# EAGLE board RASPILOT_BETA (EAGLE 7.2.0)
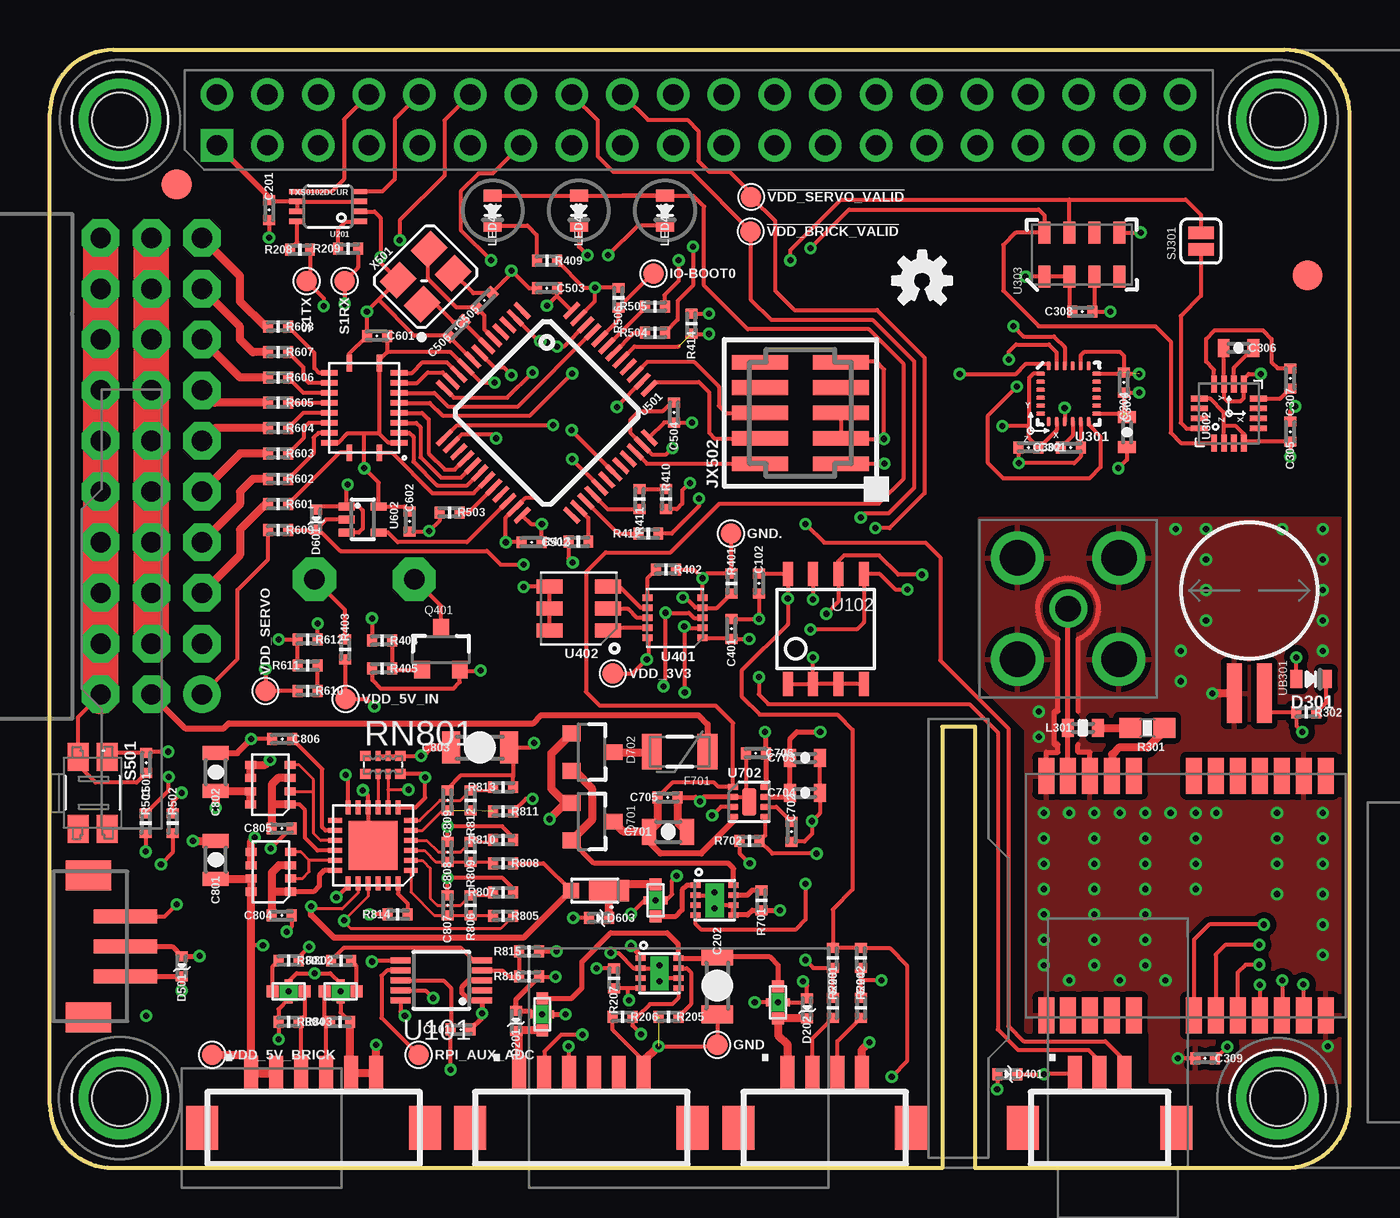
[diagram p9: board, top side]
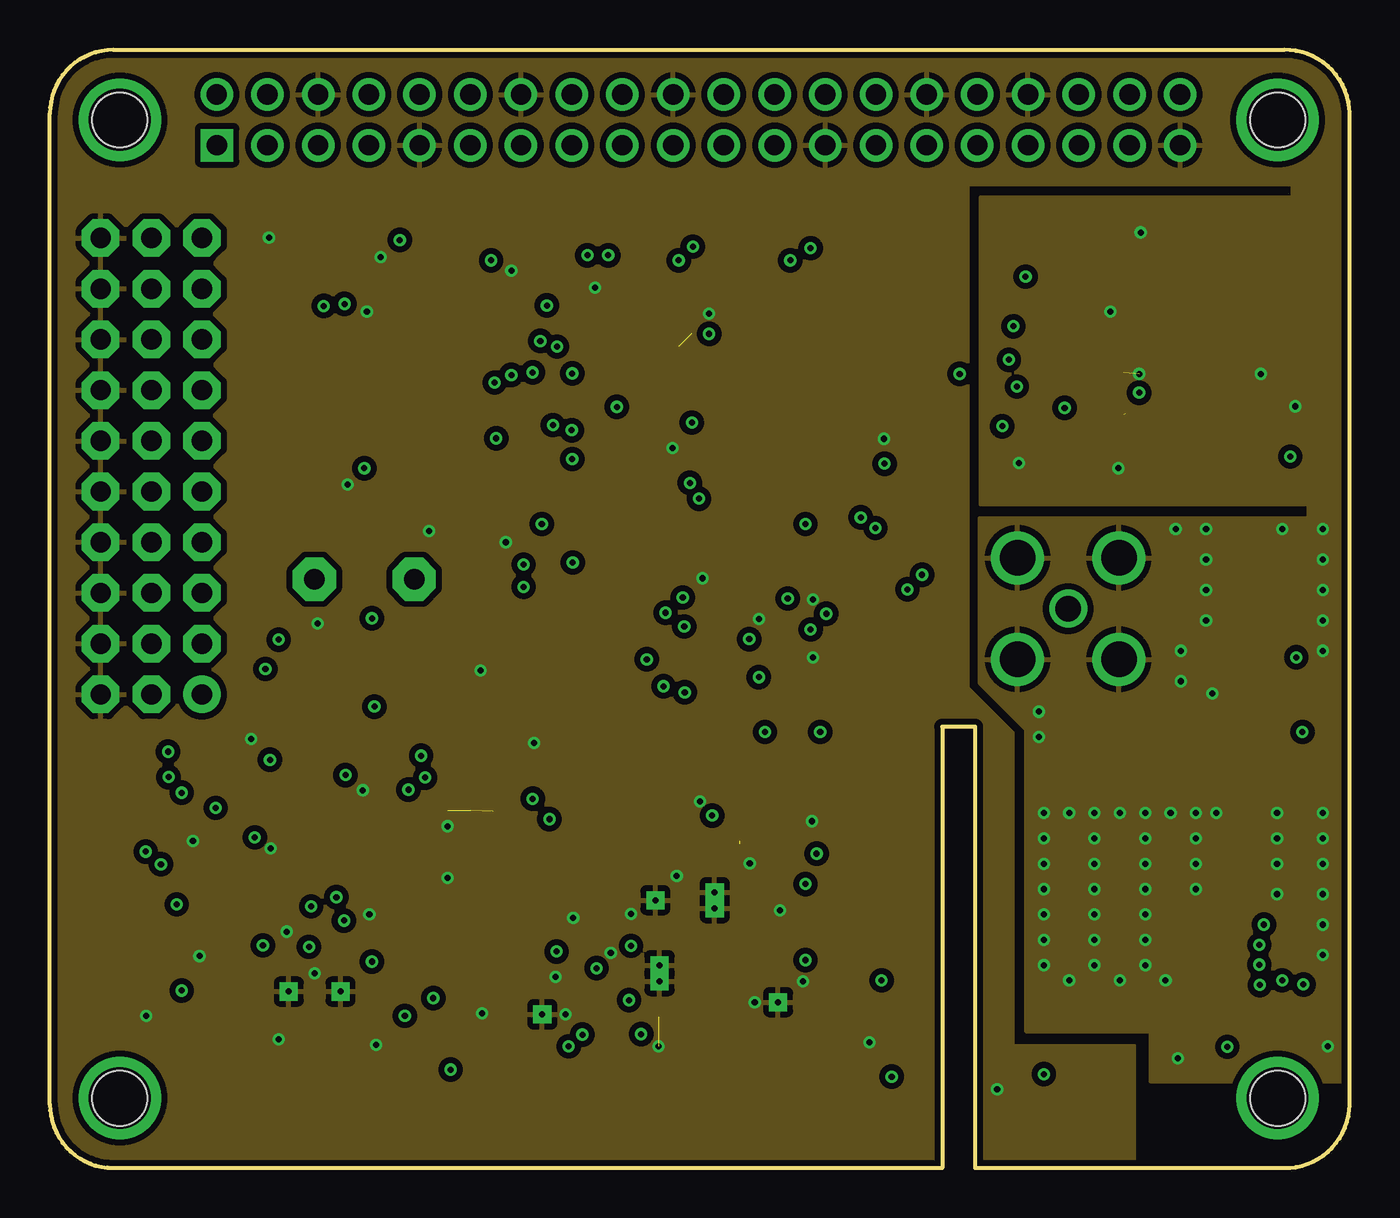
[diagram p10: board, inner layer Ground]
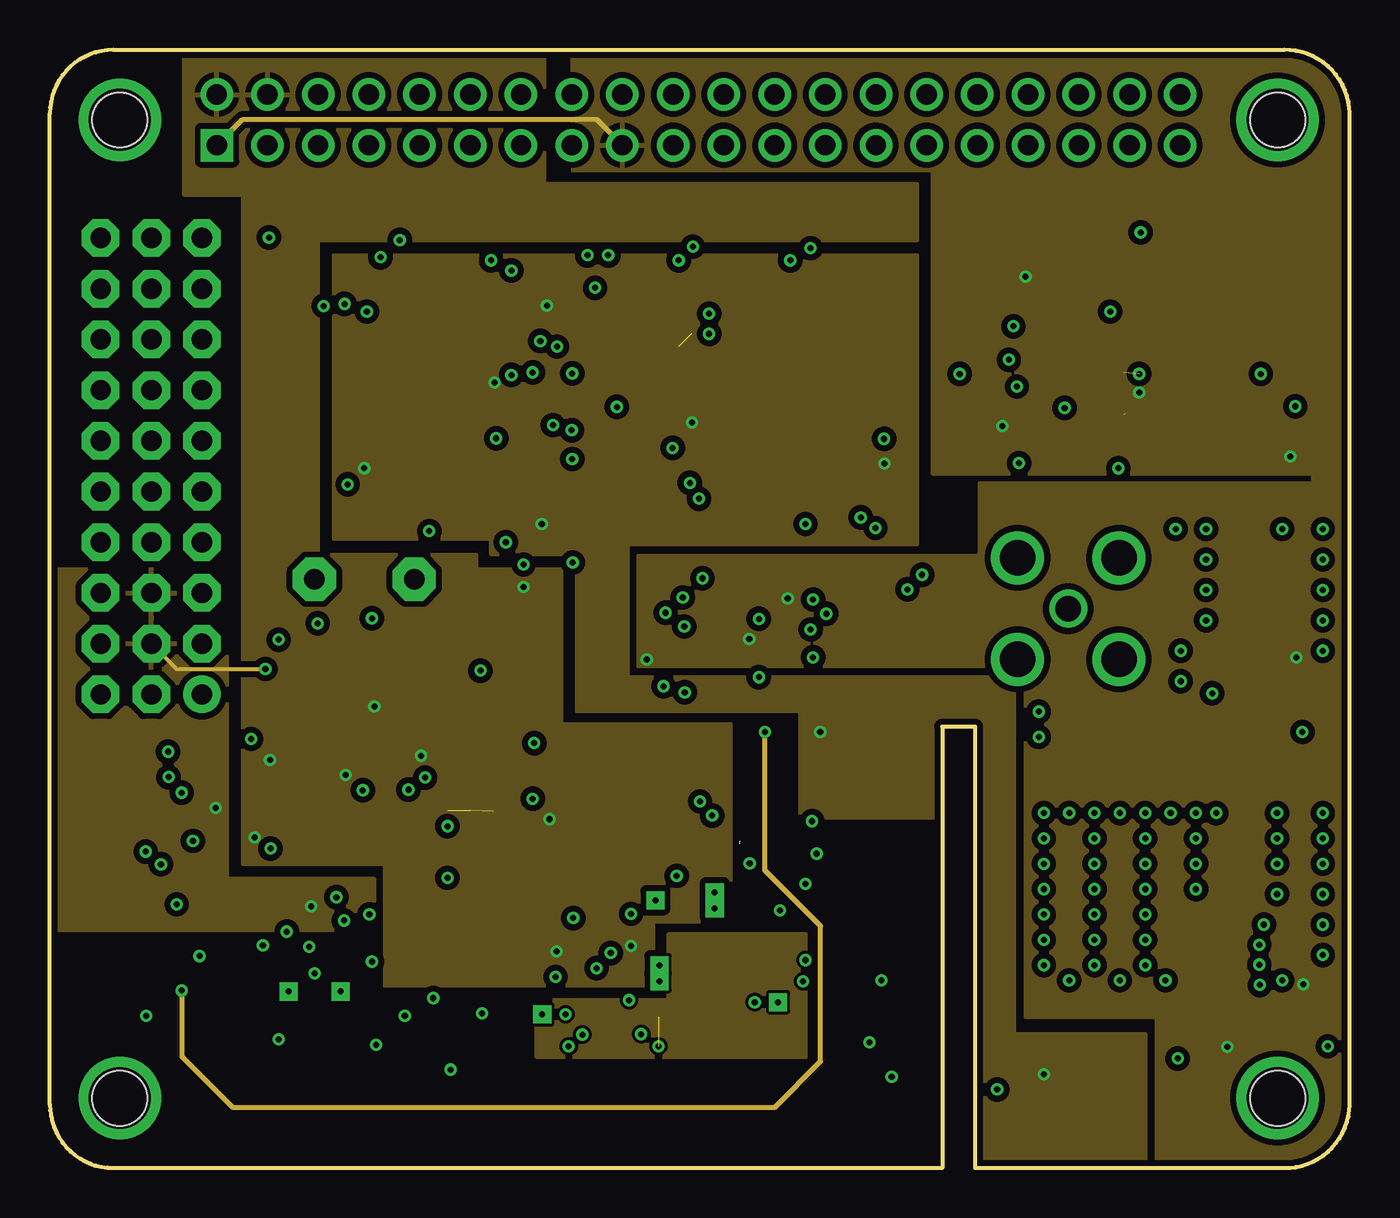
[diagram p11: board, inner layer Power]
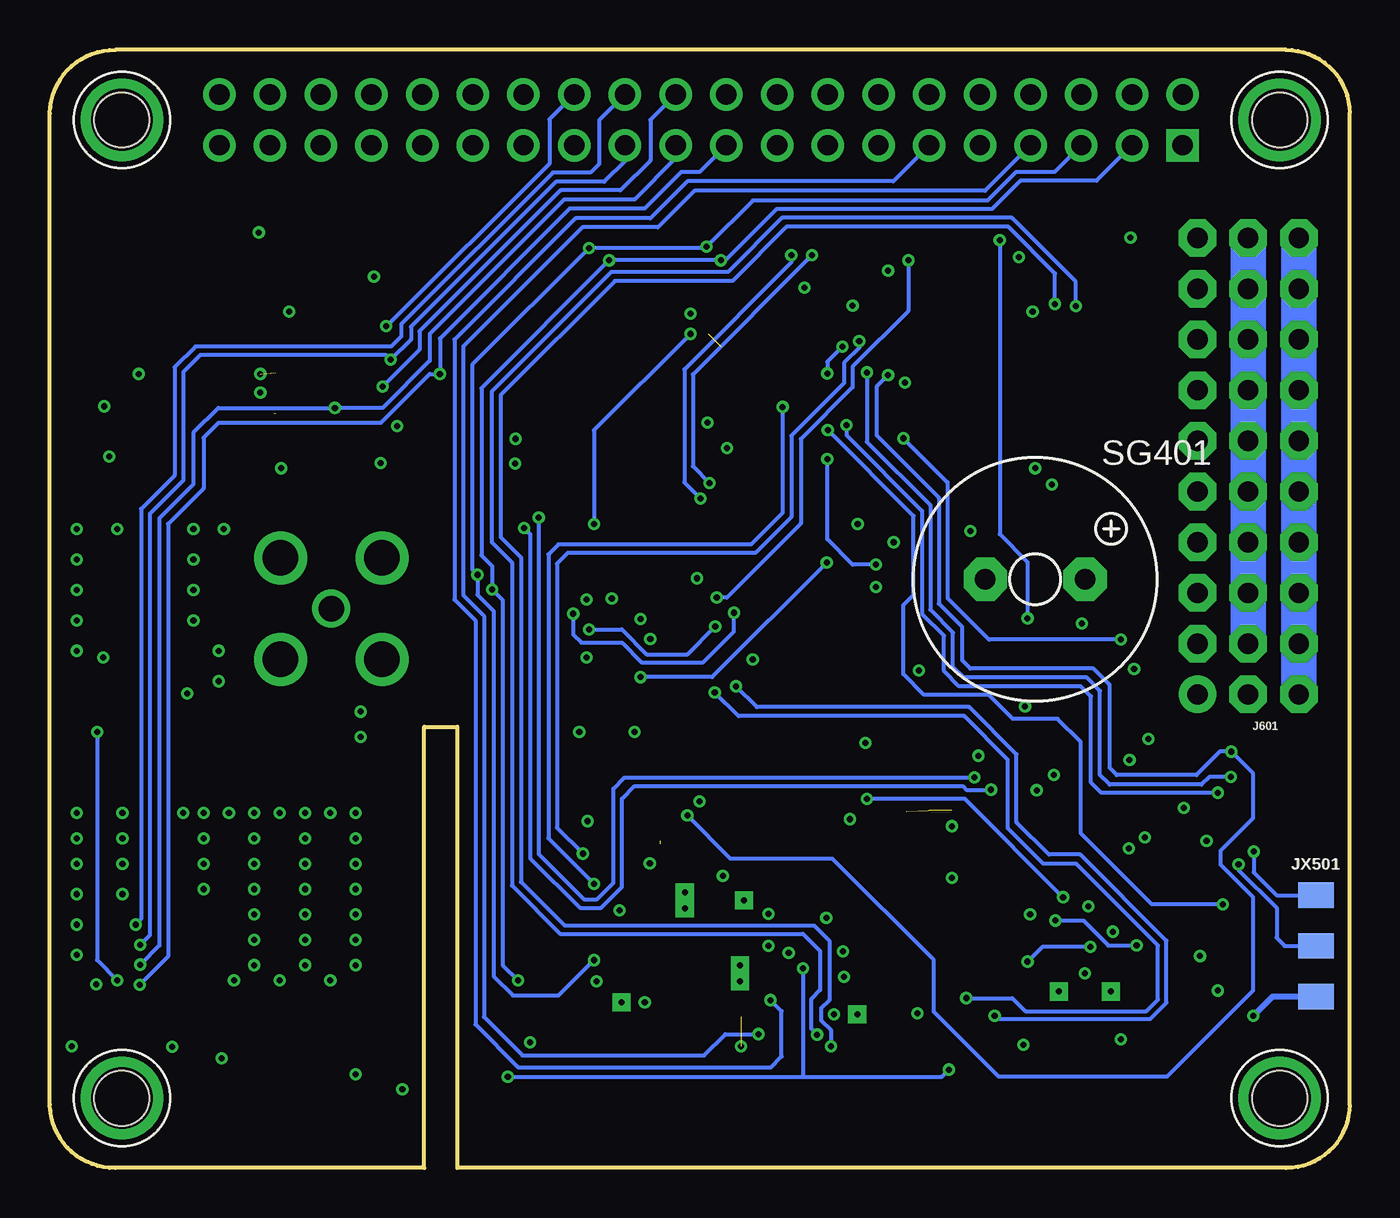
[diagram p12: board, bottom side, seen from below]

Size 65.1 x 56.01 mm. Coordinates in mm from the lower left corner, seen from the top.
Outline: 3.17,56.01 61.82,56.01 arc-90 65.1,52.83 65.1,3.17 arc-90 61.82,0 46.35,0 46.35,22.1 44.7,22.1 44.7,0 3.17,0 arc-90 0,3.17 0,52.83 arc-90 3.17,56.01
Copper layers (1*2*15*16): Top 0.035mm / dielectric 1.5mm / Ground 0.035mm / dielectric 0.15mm / Power 0.035mm / dielectric 0.2mm / Bottom 0.035mm
Design rules "SparkFun-4-layer": minimum track width 6mil, minimum drill 12mil, track to track 6mil, track to pad 6mil, pad to pad 6mil, via to via 6mil, smd to smd 6mil, copper to edge 6mil, drill to drill 8mil, minimum pad ring 12mil, minimum via ring 6mil, stop-mask expansion 4mil, vias tented up to drill 20mil, thermal gap 12mil
Net classes: 0 signal: width 0.15 mm, drill 0.15 mm, clearance 0.152 mm; 1 power: width 0.15 mm, drill 0.2 mm, clearance 0.152 mm

## Footprints (pad centres in the part's own frame; a part is rotated, then mirrored left to right if it is on the bottom)
PAD.04X.04 = smd 1.016 x 1.016: P$1 0,0
0402-CAP = smd 0.5 x 0.6: P$1 -0.5,0; P$2 0.5,0
1206-CAP = smd 0.9 x 1.6: P$1 -1.45,0; P$2 1.45,0
0603-CAP = smd 0.6 x 0.9: P$1 -0.75,0; P$2 0.75,0
0805-CAP = smd 0.7 x 1.3: P$1 -0.95,0; P$2 0.95,0
0402-TVS = smd 0.5 x 0.6: A 0.5,0; C -0.5,0
0603-DIO = smd 0.6 x 0.9: A 0.75,0; C -0.75,0
MICROSMP = smd 0.8 x 0.8: ANODE 0.65,0 | smd 2 x 1.1: CATHODE -1.25,0
SOT23-3 = smd 0.8 x 0.9: 1 -0.95,-1; 2 0.95,-1; 3 0,1.1
PTC-1206 = smd 1 x 1.8: 1 -1.4,0; 2 1.4,0
RPI2 = drill 1.016 square: P$1 8.37,51.23 | drill 1.016: P$2 8.357,53.772; P$3 10.897,51.232; P$4 10.897,53.772; P$5 13.437,51.232; P$6 13.437,53.772; P$7 15.977,51.232; P$8 15.977,53.772; P$9 18.517,51.232; P$10 18.517,53.772; P$11 21.057,51.232; P$12 21.057,53.772; P$13 23.597,51.232; P$14 23.597,53.772; P$15 26.137,51.232; P$16 26.137,53.772; P$17 28.677,51.232; P$18 28.677,53.772; P$19 31.217,51.232; P$20 31.217,53.772; P$21 33.757,51.232; P$22 33.757,53.772; P$23 36.297,51.232; P$24 36.297,53.772; P$25 38.837,51.232; P$26 38.837,53.772; P$27 41.377,51.232; P$28 41.377,53.772; P$29 43.917,51.232; P$30 43.917,53.772; P$31 46.457,51.232; P$32 46.457,53.772; P$33 48.997,51.232; P$34 48.997,53.772; P$35 51.537,51.232; P$36 51.537,53.772; P$37 54.077,51.232; P$38 54.077,53.772; P$39 56.617,51.232; P$40 56.617,53.772 | hole 2.75: 3.5,3.5; 61.5,3.5; 3.5,52.5; 61.5,52.5
DF13C-6P-1.25V = smd 0.7 x 1.8: 1 -3.125,0.9; 2 -1.875,0.9; 3 -0.625,0.9; 4 0.625,0.9; 5 1.875,0.9; 6 3.125,0.9 | smd 1.6 x 2.2: M$0 5.575,-1.8; M$1 -5.575,-1.8
DF13C-4P-1.25V = smd 0.7 x 1.8: 1 -1.875,0.9; 2 -0.625,0.9; 3 0.625,0.9; 4 1.875,0.9 | smd 1.6 x 2.2: M$0 4.325,-1.8; M$1 -4.325,-1.8
RF-MCX-H = drill 1.778: 1 -2.54,2.54; 2 -2.54,-2.54; 3 2.54,-2.54; 4 2.54,2.54 | drill 1.27: 5 0,0
DF13C-3P-1.25V = smd 0.7 x 1.8: 1 -1.25,0.9; 2 0,0.9; 3 1.25,0.9 | smd 1.6 x 2.2: M$0 3.85,-1.8; M$1 -3.85,-1.8
JST-ZH-SMT-VERTICAL = smd 0.7 x 3.2: P$1 -1.5,-1.75; P$2 0,-1.75; P$3 1.5,-1.75 | smd 1.5 x 2.3: P$4 3.55,0.1; P$5 -3.55,0.1
3X10RA = drill 1.016 pad 1.88: 1 2.54,11.43 | drill 1.016 pad 1.88 octagon: 2 0,11.43; 3 -2.54,11.43; 4 2.54,8.89; 5 0,8.89; 6 -2.54,8.89; 7 2.54,6.35; 8 0,6.35; 9 -2.54,6.35; 10 2.54,3.81; 11 0,3.81; 12 -2.54,3.81; 13 2.54,1.27; 14 0,1.27; 15 -2.54,1.27; 16 2.54,-1.27; 17 0,-1.27; 18 -2.54,-1.27; 19 2.54,-3.81; 20 0,-3.81; 21 -2.54,-3.81; 22 2.54,-6.35; 23 0,-6.35; 24 -2.54,-6.35; 25 2.54,-8.89; 26 0,-8.89; 27 -2.54,-8.89; 28 2.54,-11.43; 29 0,-11.43; 30 -2.54,-11.43
FIDUCIAL-1.5X3 = smd 1.5 x 1.5: 1 0,0
HEADER_3X01_SMD_H_BOARD_EDGE_SHORT = smd 1.27 x 1.778: 1 -2.54,0; 2 0,0; 3 2.54,0
FTSH-105-01-XXX-DV-K = smd 0.737 x 2.794: 1 -2.54,-2.032; 2 -2.54,2.032; 3 -1.27,-2.032; 4 -1.27,2.032; 5 0,-2.032; 6 0,2.032; 7 1.27,-2.032; 8 1.27,2.032; 9 2.54,-2.032; 10 2.54,2.032
KYOCERA-KNH16-DA = smd 0.6 x 0.6: P$1 -0.8,0; P$2 0.8,0 | smd 0.4 x 0.4: P$3 0,-0.4; P$4 0,0.4 | drill 0.3 pad 0.4 square: P$5 0,0
0603-IND = smd 0.6 x 0.9: P$1 -0.75,0; P$2 0.75,0
0603-LED = smd 0.6 x 0.9: A 0.75,0; C -0.75,0
MOUNT-HOLE3.1 = drill 3.1 pad 4.1: P$1 0,0
0402-RES = smd 0.5 x 0.6: P$1 -0.5,0; P$2 0.5,0
0603-RES = smd 1.1 x 1: 1 -0.85,0; 2 0.85,0
EXB28V = smd 0.525 x 0.5: 1 -0.875,-0.45; 4 0.875,-0.45; 5 0.875,0.45; 8 -0.875,0.45 | smd 0.25 x 0.5: 2 -0.25,-0.45; 3 0.25,-0.45; 6 0.25,0.45; 7 -0.25,0.45
EVQP7J01K = smd 1.4 x 1.05: A1 -1.8,0.725; A2 1.8,0.725; B3 -1.8,-0.725; B4 1.8,-0.725
F/TMB = drill 1.016 pad 2.159 octagon: + 2.5,0; - -2.5,0
SJ_2S = smd 0.635 x 1.27: 1 -0.412,0; 2 0.412,0
MSOP10 = smd 0.3 x 1: 1 -1,-2.05; 2 -0.5,-2.05; 3 0,-2.05; 4 0.5,-2.05; 5 1,-2.05; 6 1,2.05; 7 0.5,2.05; 8 0,2.05; 9 -0.5,2.05; 10 -1,2.05
SOP8 = smd 0.5 x 1.2: 1 -1.905,-2.75; 2 -0.635,-2.75; 3 0.635,-2.75; 4 1.905,-2.75; 5 1.905,2.75; 6 0.635,2.75; 7 -0.635,2.75; 8 -1.905,2.75
TI-DCU = smd 0.27 x 0.8: 1 -0.75,-1.55; 2 -0.25,-1.55; 3 0.25,-1.55; 4 0.75,-1.55; 5 0.75,1.55; 6 0.25,1.55; 7 -0.25,1.55; 8 -0.75,1.55
QFN8-DSG = smd 0.28 x 0.5: 1 -0.75,-0.95; 2 -0.25,-0.95; 3 0.25,-0.95; 4 0.75,-0.95; 5 0.75,0.95; 6 0.25,0.95; 7 -0.25,0.95; 8 -0.75,0.95 | smd 1.6 x 0.9: GND 0,0 | drill 0.3 square: P$2 -0.4,0; P$3 0.4,0
MPU-6500 = smd 0.45 x 0.22: 1 -1.4,1; 2 -1.4,0.6; 3 -1.4,0.2; 4 -1.4,-0.2; 5 -1.4,-0.6; 6 -1.4,-1; 13 1.4,-1; 14 1.4,-0.6; 15 1.4,-0.2; 16 1.4,0.2; 17 1.4,0.6; 18 1.4,1 | smd 0.22 x 0.45: 7 -1,-1.4; 8 -0.6,-1.4; 9 -0.2,-1.4; 10 0.2,-1.4; 11 0.6,-1.4; 12 1,-1.4; 19 1,1.4; 20 0.6,1.4; 21 0.2,1.4; 22 -0.2,1.4; 23 -0.6,1.4; 24 -1,1.4
HMC5883L-MAN = smd 0.85 x 0.285: 1 -1.475,0.75; 2 -1.475,0.25; 3 -1.475,-0.25; 4 -1.475,-0.75; 9 1.475,-0.75; 10 1.475,-0.25; 11 1.475,0.25; 12 1.475,0.75 | smd 0.285 x 0.85: 5 -0.75,-1.475; 6 -0.25,-1.475; 7 0.25,-1.475; 8 0.75,-1.475; 13 0.75,1.475; 14 0.25,1.475; 15 -0.25,1.475; 16 -0.75,1.475
MS5611-01BA = smd 1.1 x 0.6: 1 -1.1,1.875; 2 -1.1,0.625; 3 -1.1,-0.625; 4 -1.1,-1.875; 5 1.1,-1.875; 6 1.1,-0.625; 7 1.1,0.625; 8 1.1,1.875
NEO-M8N = smd 1.798 x 0.8: 1 12.101,0.998; 2 12.101,2.098; 3 12.101,3.198; 4 12.101,4.298; 5 12.101,5.397; 6 12.101,6.497; 7 12.101,7.597; 8 12.101,10.597; 9 12.101,11.697; 10 12.101,12.797; 11 12.101,13.896; 12 12.101,14.996; 13 0.099,14.996; 14 0.099,13.896; 15 0.099,12.797; 16 0.099,11.697; 17 0.099,10.597; 18 0.099,7.597; 19 0.099,6.497; 20 0.099,5.397; 21 0.099,4.298; 22 0.099,3.198; 23 0.099,2.098; 24 0.099,0.998
SON10 = smd 0.32 x 0.5: 1 -1,-1.375; 2 -0.5,-1.375; 3 0,-1.375; 4 0.5,-1.375; 5 1,-1.375; 6 1,1.375; 7 0.5,1.375; 8 0,1.375; 9 -0.5,1.375; 10 -1,1.375
6-PLCC = smd 1.3 x 0.7: A1 1.475,1.1; A2 1.475,0; A3 1.475,-1.1; C1 -1.475,1.1; C2 -1.475,0; C3 -1.475,-1.1
TQFP48 = smd 0.24 x 1: 1 -2.75,-4.5; 2 -2.25,-4.5; 3 -1.75,-4.5; 4 -1.25,-4.5; 5 -0.75,-4.5; 6 -0.25,-4.5; 7 0.25,-4.5; 8 0.75,-4.5; 9 1.25,-4.5; 10 1.75,-4.5; 11 2.25,-4.5; 12 2.75,-4.5; 25 2.75,4.5; 26 2.25,4.5; 27 1.75,4.5; 28 1.25,4.5; 29 0.75,4.5; 30 0.25,4.5; 31 -0.25,4.5; 32 -0.75,4.5; 33 -1.25,4.5; 34 -1.75,4.5; 35 -2.25,4.5; 36 -2.75,4.5 | smd 1 x 0.24: 13 4.5,-2.75; 14 4.5,-2.25; 15 4.5,-1.75; 16 4.5,-1.25; 17 4.5,-0.75; 18 4.5,-0.25; 19 4.5,0.25; 20 4.5,0.75; 21 4.5,1.25; 22 4.5,1.75; 23 4.5,2.25; 24 4.5,2.75; 37 -4.5,2.75; 38 -4.5,2.25; 39 -4.5,1.75; 40 -4.5,1.25; 41 -4.5,0.75; 42 -4.5,0.25; 43 -4.5,-0.25; 44 -4.5,-0.75; 45 -4.5,-1.25; 46 -4.5,-1.75; 47 -4.5,-2.25; 48 -4.5,-2.75
QFN20-RGY = smd 0.28 x 0.85: 1 -0.75,2.25; 10 -0.75,-2.25; 11 0.75,-2.25; 20 0.75,2.25 | smd 0.85 x 0.28: 2 -1.75,1.75; 3 -1.75,1.25; 4 -1.75,0.75; 5 -1.75,0.25; 6 -1.75,-0.25; 7 -1.75,-0.75; 8 -1.75,-1.25; 9 -1.75,-1.75; 12 1.75,-1.75; 13 1.75,-1.25; 14 1.75,-0.75; 15 1.75,-0.25; 16 1.75,0.25; 17 1.75,0.75; 18 1.75,1.25; 19 1.75,1.75
SOT353 = smd 0.4 x 0.8: 1 -0.65,-0.8; 2 0,-0.8; 3 0.65,-0.8; 4 0.65,0.8; 5 -0.65,0.8
MLF-8-EPAD = smd 0.5 x 0.3: 1 -0.8,0.75; 2 -0.8,0.25; 3 -0.8,-0.25; 4 -0.8,-0.75; 5 0.8,-0.75; 6 0.8,-0.25; 7 0.8,0.25; 8 0.8,0.75 | smd 0.7 x 1.4: GND 0,0
MO-220 = smd 0.7 x 0.25: P$1 -1.9,1.25; P$2 -1.9,0.75; P$3 -1.9,0.25; P$4 -1.9,-0.25; P$5 -1.9,-0.75; P$6 -1.9,-1.25; P$13 1.9,-1.25; P$14 1.9,-0.75; P$15 1.9,-0.25; P$16 1.9,0.25; P$17 1.9,0.75; P$18 1.9,1.25 | smd 0.25 x 0.7: P$7 -1.25,-1.9; P$8 -0.75,-1.9; P$9 -0.25,-1.9; P$10 0.25,-1.9; P$11 0.75,-1.9; P$12 1.25,-1.9; P$19 1.25,1.9; P$20 0.75,1.9; P$21 0.25,1.9; P$22 -0.25,1.9; P$23 -0.75,1.9; P$24 -1.25,1.9 | smd 2.45 x 2.45: P$25 0,0
1206-8 = smd 0.406 x 0.559: P$1 -0.991,-0.991; P$2 -0.33,-0.991; P$3 0.33,-0.991; P$4 0.991,-0.991; P$5 0.991,0.991; P$6 0.33,0.991; P$7 -0.33,0.991; P$8 -0.991,0.991
MS621FE = smd 3 x 0.75: 1 5.15,0.75; 2 5.15,-0.75
OSCILLATOR-3.2X2.5 = smd 1.4 x 1.2: 1 -1.1,-0.85; 2 1.1,-0.85; 3 1.1,0.85; 4 -1.1,0.85

## Placement (x,y rotation side)
!VDD_BRICK_VALID  PAD.04  [PAD.04X.04]  35.1,46.91 0 top
!VDD_SERVO_VALID  PAD.04  [PAD.04X.04]  35.13,48.64 0 top
C101  0u1  [0402-CAP]  20.57,6.93 0 top
C102  0u1  [0402-CAP]  35.51,29.29 270 top
C201  0u1  [0402-CAP]  10.97,47.98 270 top
C202  100u  [1206-CAP]  33.43,9.14 270 top
C301  0u01  [0402-CAP]  49.02,36.09 180 top
C302  0u1  [0402-CAP]  51.13,36.09 0 top
C303  2u2  [0603-CAP]  53.95,36.86 270 top
C304  0u1  [0402-CAP]  53.8,39.34 90 top
C305  0u1  [0402-CAP]  62.13,36.88 90 top
C306  4u7  [0603-CAP]  59.54,41.07 180 top
C307  0u22  [0402-CAP]  62.13,39.55 90 top
C308  0u1  [0402-CAP]  51.71,42.9 0 top
C309  0u1  [0402-CAP]  57.86,5.49 180 top
C401  0u1  [0402-CAP]  34.14,27 90 top
C501  0u1  [0402-CAP]  4.83,20.29 90 top
C502  0u1  [0402-CAP]  24.13,31.34 180 top
C503  0u1  [0402-CAP]  24.89,44.07 180 top
C504  0u1  [0402-CAP]  31.27,37.85 90 top
C505  8p  [0402-CAP]  21.76,43.46 45 top
C506  8p  [0402-CAP]  20.35,42.04 45 top
C601  0u1  [0402-CAP]  16.38,41.68 180 top
C602  0u1  [0402-CAP]  18.01,32.38 270 top
C701  10u/25V  [0805-CAP]  30.96,16.84 0 top
C702  10n  [0402-CAP]  37.13,16.84 270 top
C703  1u  [0603-CAP]  37.82,20.55 0 top
C704  10u  [0603-CAP]  37.82,18.8 0 top
C705  0u1  [0402-CAP]  30.94,18.57 0 top
C706  2u2  [0402-CAP]  35.36,20.78 180 top
C801  22u/25V  [0805-CAP]  8.31,15.44 90 top
C802  22u/25V  [0805-CAP]  8.31,19.84 90 top
C803  100u  [1206-CAP]  21.54,21.06 0 top
C804  0u1  [0402-CAP]  11.61,12.65 0 top
C805  0u1  [0402-CAP]  11.61,17.02 0 top
C806  0u1  [0402-CAP]  11.63,21.49 180 top
C807  10p/25V  [0402-CAP]  19.91,13.16 90 top
C808  10p/25V  [0402-CAP]  19.91,15.82 90 top
C809  1000p/25V  [0402-CAP]  19.91,18.41 90 top
D201  PESD0402-140  [0402-TVS]  23.34,7.37 90 top
D202  PESD0402-140  [0402-TVS]  37.92,8 90 top
D301  [0603-DIO]  63.17,24.49 180 top
D401  PESD0402-140  [0402-TVS]  47.96,4.7 180 top
D501  PESD0402-140  [0402-TVS]  6.6,10.11 90 top
D601  PESD0402-140  [0402-TVS]  13.34,32.49 90 top
D602  MSS1P4-M3  [MICROSMP]  26.75,13.89 180 top
D603  PESD0402-140  [0402-TVS]  27.51,12.52 180 top
D701  PMEG2005CT  [SOT23-3]  27.13,17.35 270 top
D702  PMEG2005CT  [SOT23-3]  27.13,20.83 270 top
F701  0ZCA0035FF2G  [PTC-1206]  31.55,20.85 180 top
GND  PAD.04  [PAD.04X.04]  33.43,6.17 0 top
GND.  PAD.04  [PAD.04X.04]  34.11,31.78 0 top
IO-BOOT0  PAD.04  [PAD.04X.04]  30.23,44.81 0 top
J101  RPI2  [RPI2]  0,0 0 top
J201  DF13C-6P-1.25V  [DF13C-6P-1.25V]  26.62,3.81 0 top
J202  DF13C-4P-1.25V  [DF13C-4P-1.25V]  38.81,3.81 0 top
J301  RF-MCX  [RF-MCX-H]  51,28.02 0 top
J401  DF13C-3P-1.25V  [DF13C-3P-1.25V]  52.58,3.81 0 top
J501  JST-ZH-3  [JST-ZH-SMT-VERTICAL]  2.03,11.1 90 top
J601  HEADER-3X10  [3X10RA]  5.08,35.15 180 bottom
J801  DF13C-6P-1.25V  [DF13C-6P-1.25V]  13.21,3.81 0 top
JP1  FIDUCIAL1.5X3  [FIDUCIAL-1.5X3]  62.99,44.7 0 top
JP2  FIDUCIAL1.5X3  [FIDUCIAL-1.5X3]  6.35,49.28 0 top
JX501  HEADER-3X1BOARDEDGE-SHORT  [HEADER_3X01_SMD_H_BOARD_EDGE_SHORT]  1.68,11.13 270 bottom
JX502  ARM_MINI_JTAG-SMT  [FTSH-105-01-XXX-DV-K]  37.59,37.82 90 top
L201  KNH16C104DA5TS  [KYOCERA-KNH16-DA]  24.66,7.7 270 top
L202  KNH16C104DA5TS  [KYOCERA-KNH16-DA]  36.47,8.31 270 top
L301  100nH  [0603-IND]  51.74,22.05 0 top
L601  KNH16C104DA5TS  [KYOCERA-KNH16-DA]  30.33,13.41 270 top
L801  KNH16C104DA5TS  [KYOCERA-KNH16-DA]  11.96,8.84 180 top
L802  KNH16C104DA5TS  [KYOCERA-KNH16-DA]  14.55,8.84 0 top
LED402  GREEN  [0603-LED]  22.17,47.96 90 top
LED403  AMBER  [0603-LED]  26.49,47.96 90 top
LED405  BLUE  [0603-LED]  30.81,47.96 90 top
M3_MOUNT1101  MOUNT-HOLE3.1MM  [MOUNT-HOLE3.1]  61.49,3.51 0 top
M3_MOUNT1102  MOUNT-HOLE3.1MM  [MOUNT-HOLE3.1]  3.51,3.51 0 top
M3_MOUNT1103  MOUNT-HOLE3.1MM  [MOUNT-HOLE3.1]  61.49,52.5 0 top
M3_MOUNT1104  MOUNT-HOLE3.1MM  [MOUNT-HOLE3.1]  3.51,52.5 0 top
OSHW_LOGO  OSHW-LOGOS  [OSHW-LOGO-S]  43.69,44.45 0 top
Q401  MOSFET-NCHANNELSMD  [SOT23-3]  19.58,25.96 0 top
R201  1K5  [0402-RES]  39.22,10.52 90 top
R202  1K5  [0402-RES]  40.61,10.52 90 top
R203  120R  [0402-RES]  39.22,8.03 270 top
R204  120R  [0402-RES]  40.61,8.03 270 top
R205  16K5  [0402-RES]  30.99,7.57 180 top
R206  10K  [0402-RES]  28.68,7.57 180 top
R207  1M  [0402-RES]  28.24,9.5 90 top
R208  220R  [0402-RES]  12.52,46 0 top
R209  220R  [0402-RES]  14.94,46.05 0 top
R301  10R  [0603-RES]  54.97,22.05 180 top
R302  1K  [0402-RES]  62.94,22.81 180 top
R401  10K  [0402-RES]  34.14,29.29 270 top
R402  10K  [0402-RES]  30.86,29.97 180 top
R403  220R  [0402-RES]  14.78,25.98 270 top
R404  220R  [0402-RES]  16.64,26.42 180 top
R405  10K  [0402-RES]  16.64,25.02 180 top
R409  220R  [0402-RES]  24.89,45.44 180 top
R410  220R  [0402-RES]  30.86,33.5 270 top
R411  220R  [0402-RES]  29.54,33.5 90 top
R412  220R  [0402-RES]  29.97,31.78 0 top
R413  68R  [0402-RES]  26.47,31.37 0 top
R414  1K5  [0402-RES]  32.13,42.29 90 top
R501  220R  [0402-RES]  4.8,17.27 270 top
R502  220R  [0402-RES]  6.15,17.27 270 top
R503  10K  [0402-RES]  20.02,32.84 180 top
R504  120R  [0402-RES]  30.3,41.83 0 top
R505  120R  [0402-RES]  30.3,43.15 0 top
R506  10K  [0402-RES]  28.47,43.59 90 top
R601  220R  [0402-RES]  11.43,33.25 180 top
R602  220R  [0402-RES]  11.43,34.52 180 top
R603  220R  [0402-RES]  11.43,35.79 180 top
R604  220R  [0402-RES]  11.43,37.06 180 top
R605  220R  [0402-RES]  11.43,38.33 180 top
R606  220R  [0402-RES]  11.43,39.6 180 top
R607  220R  [0402-RES]  11.43,40.87 180 top
R608  220R  [0402-RES]  11.43,42.14 180 top
R609  220R  [0402-RES]  11.43,31.95 180 top
R610  10K/0.1%  [0402-RES]  12.9,23.9 180 top
R611  10K/0.1%  [0402-RES]  12.9,25.17 0 top
R612  10K/0.1%  [0402-RES]  12.9,26.47 180 top
R701  100K  [0402-RES]  35.64,13.41 90 top
R702  10K  [0402-RES]  35.05,16.38 0 top
R801  10K/0.1%  [0402-RES]  11.96,10.39 180 top
R802  10K/0.1%  [0402-RES]  14.58,10.39 0 top
R803  1M  [0402-RES]  14.53,7.32 0 top
R804  1M  [0402-RES]  11.96,7.32 180 top
R805  453K  [0402-RES]  22.71,12.62 180 top
R806  56K  [0402-RES]  21.08,13.16 90 top
R807  105K  [0402-RES]  22.71,13.82 0 top
R808  453K  [0402-RES]  22.71,15.27 180 top
R809  56K  [0402-RES]  21.08,15.82 90 top
R810  105K  [0402-RES]  22.71,16.43 0 top
R811  453K  [0402-RES]  22.71,17.86 180 top
R812  56K  [0402-RES]  21.08,18.41 90 top
R813  105K  [0402-RES]  22.71,19.08 0 top
R814  0R  [0402-RES]  17.42,12.7 0 top
R815  10K/0.1%  [0402-RES]  24,10.85 0 top
R816  10K/0.1%  [0402-RES]  24,9.6 0 top
RN801  1M  [EXB28V]  16.69,20.19 0 top
RPI_AUX_ADC  PAD.04  [PAD.04X.04]  18.47,5.66 0 top
S1RX  PAD.04  [PAD.04X.04]  14.76,44.42 270 top
S1TX  PAD.04  [PAD.04X.04]  12.85,44.42 270 top
S501  RESET  [EVQP7J01K]  2.13,18.8 270 top
SG401  BUZZER  [F/TMB]  15.75,29.49 0 bottom
SJ301  SOLDERJUMPERNC  [SJ_2S]  57.66,46.43 90 top
U101  ADS1015  [MSOP10]  19.61,9.4 90 top
U102  MB85RC  [SOP8]  38.86,27 0 top
U201  TXS0102DCUR  [TI-DCU]  13.94,48.16 90 top
U202  BQ24315  [QFN8-DSG]  30.53,9.75 270 top
U301  MPU-6500  [MPU-6500]  51.03,38.79 0 top
U302  HMC5883L  [HMC5883L-MAN]  59.05,37.8 90 top
U303  MS5611-01BA  [MS5611-01BA]  51.69,45.75 90 top
U304  NEO-M8N  [NEO-M8N]  64.9,7.54 90 top
U401  TCA62724FMG  [SON10]  31.32,27.56 90 top
U402  LRTB GFTG-T7AW-1+V7A7-29+R5T9-49-L  [6-PLCC]  26.49,28.02 180 top
U501  STM32F10XCXT6  [TQFP48]  24.89,37.82 225 top
U601  TXS0108QFN20  [QFN20-RGY]  15.75,38.07 180 top
U602  74LVC1G125-SOT353  [SOT353]  15.67,32.49 270 top
U701  BQ24313  [QFN8-DSG]  33.3,13.41 270 top
U702  MIC5332  [MLF-8-EPAD]  35.03,18.34 0 top
U801  LTC4417  [MO-220]  16.18,16.15 180 top
U802  NTHD4102PT1G  [1206-8]  11.07,14.83 90 top
U803  NTHD4102PT1G  [1206-8]  11.05,19.2 90 top
UB301  MS621FE  [MS621FE]  60.07,28.93 270 top
VDD_3V3  PAD.04  [PAD.04X.04]  28.19,24.77 0 top
VDD_5V_BRICK  PAD.04  [PAD.04X.04]  8.13,5.66 0 top
VDD_5V_IN  PAD.04  [PAD.04X.04]  14.81,23.5 0 top
VDD_SERVO  PAD.04  [PAD.04X.04]  10.79,23.9 90 top
X501  3.2x2.5 mm / 8 MHz / 15 ppm  [OSCILLATOR-3.2X2.5]  18.82,44.65 45 top

## Tracks (layer width: path | path; a pad name or v marks a point on that pad's centre or on a via)
!IO-LED_AMBER
  Top 0.203: U501.28 27.94,33 R411.P$1
!IO-LED_BLUE
  Top 0.203: U501.27 28.46,31.77 R412.P$1
!IO-LED_SAFETY
  Top 0.203: U501.26 26.97,32.56 R413.P$2
!RPI-SPI_CE0  (via drill 0.3 pad 0.46)
  Top 0.203: v60.81,12.19 58.06,12.19 57.3,11.43 U304.18
  Bottom 0.203: J101.P$24 37.59,52.48 37.59,50.29 38.02,49.86 39.9,49.86 47.5,42.27 47.5,41.66 48.01,41.15 57.81,41.15 58.85,40.11 58.85,34.7 60.53,33.02 60.53,12.47 v60.81,12.19
!RPI-SPI_CE1  (via drill 0.3 pad 0.46)
  Top 0.203: v48.26,42.16 48.77,41.66 50.29,41.66 50.83,41.12 U301.22
  Bottom 0.203: J101.P$26 40.08,52.53 40.08,50.32 48.23,42.16 v48.26,42.16
!VDD_5V_PERIPH_EN  (via drill 0.3 pad 0.46)
  Top 0.203: R206.P$1 29.18,7.14 v29.62,6.71 | R206.P$1 29.18,7.62 | U202.5 31.48,8.52 31.17,8.2 30.05,8.2 29.41,7.57 R206.P$1
  Bottom 0.203: J101.P$7 18.26,48.95 32.82,48.95 34.65,47.12 38.43,47.12 44.4,41.15 44.4,28.7 43.36,27.66 43.36,7.57 41.43,5.64 32.33,5.64 31.27,6.71 v29.62,6.71
!VDD_5V_PERIPH_OC  (via drill 0.3 pad 0.46)
  Top 0.203: U202.4 28.96,9 | 28.96,9 R207.P$1 | v29.01,8.41 28.96,8.46 28.96,9
  Bottom 0.203: J101.P$11 22.86,49.43 33.17,49.43 35.03,47.57 38.76,47.57 44.83,41.5 44.83,28.47 43.79,27.43 43.79,7.19 41.66,5.05 28.98,5.05 28.45,5.59 28.45,7.85 v29.01,8.41
!VDD_BRICK_VALID  (via drill 0.3 pad 0.46)
  Top 0.203: J101.P$16 27.43,52.48 27.43,50.67 28.19,49.91 32.13,49.91 35.1,46.94 !VDD_BRICK_VALID.P$1 35.1,43.51 36.12,42.49 41.2,42.49 43.28,40.41 43.28,34.06 42.01,32.79 40.82,32.79 v40.62,32.59 | RN801.4 18.61,19.74 v18.8,19.56 18.8,18.54 18.31,18.05 U801.P$7
  Bottom 0.203: v40.62,32.59 40.62,15.72 38.35,13.46 37.69,13.46 36.88,14.28 36.88,19 36.32,19.56 v18.8,19.56
!VDD_SERVO_VALID  (via drill 0.3 pad 0.46)
  Top 0.152: RN801.3 16.94,18.95 | 16.94,18.95 16.94,18.06 | v17.96,18.95 16.94,18.95
  Top 0.203: 16.94,18.06 U801.P$8 | J101.P$18 29.95,52.5 31.93,52.5 32.49,51.94 32.49,50.44 33.02,49.91 34.04,49.91 35.13,48.82 !VDD_SERVO_VALID.P$1 36.32,47.45 36.32,43.94 37.29,42.98 41.43,42.98 43.81,40.59 43.81,33.81 42.06,32.05 v41.35,32.05
  Bottom 0.203: v17.96,18.95 19.2,18.95 19.38,19.13 35.81,19.13 36.45,18.49 36.45,14.07 37.49,13.03 38.56,13.03 41.05,15.52 41.05,31.75 v41.35,32.05
ALARM  (via drill 0.3 pad 0.46)
  Top 0.203: J101.P$12 19.76,52.48 19.76,49.71 17.53,47.47 v17.53,46.48 | v16.13,27.53 R404.P$2
  Bottom 0.203: v17.53,46.48 17.53,31.75 16.13,30.35 v16.13,27.53
BATT_CURRENT_SENS  (via drill 0.3 pad 0.46)
  Top 0.203: R801.P$1 12.46,10.56 v12.98,11.07 | v16.13,10.34 16.19,10.4 U101.6
  Bottom 0.203: v12.98,11.07 15.39,11.07 v16.13,10.34
BATT_CURRENT_SENS_PROT
  Top 0.203: J801.3 12.58,7.2 R804.P$1 12.76,7.62 L801.P$1
BATT_VOLTAGE_SENS
  Top 0.203: U101.5 21.23,10.4 20.6,11.02 14.71,11.02 R802.P$1
BATT_VOLTAGE_SENS_PROT
  Top 0.203: J801.4 13.83,7.12 R803.P$1 13.75,7.59 L802.P$1
GND  (via drill 0.3 pad 0.25, 0.3 pad 0.46)  (3 unrouted)
  Top 0.152: R414.P$2
  Top 0.203: U501.8 20,41.65 C506.P$1 18.25,41.69 16.45,43.49 | U601.11 15,40.8 C601.P$2 v15.88,42.89 v15.88,42.9 v15.88,42.91 16.45,43.49 | C703.P$2 C704.P$2 38.57,17.77 v38.18,17.37 38.18,16.74 37.8,16.36 37.15,16.36 C702.P$2 | 31.46,18.59 C705.P$2 | U702.2 34.78,18.59 U702.GND 34.86,18.51 C706.P$2 | U301.18 v54.55,39.79 v54.56,39.78 | U303.3 52.31,43 C308.P$2 v53.11,42.9 | C306.P$2 58.8,41.05 U302.11 58.8,38.58 58.98,38.41 59.64,38.41 59.79,38.56 59.79,39.26 U302.9 59.8,39.54 60.05,39.78 v60.66,39.78 | C309.P$2 v56.49,5.49 | v58.22,23.78 v58.22,23.77 | R405.P$2 16.15,25 16.15,24.43 16.59,24 20.19,24 20.52,24.33 Q401.2 20.53,24.9 21.55,24.9 v21.57,24.92 | L801.P$4 11.94,8.44 11.46,7.95 R804.P$2 | 14.65,8.44 L802.P$3 14.55,7.79 R803.P$2 15.01,7.33 | C201.P$2 v10.97,46.61 | 20.33,44.96 X501.2 21.22,43.81 C505.P$2 23.11,44.81 v23.11,44.96 24,44.07 C503.P$2 | 16.45,43.49 X501.4 16.56,45.36 v16.56,45.62 16.56,47.6 16.25,47.91 U201.2 | R506.P$2 27.31,44.09 v27.3,44.09 | U501.47 27.3,43.42 v27.3,44.09 | R409.P$1 26.74,44.09 v27.3,44.09 | JX502.5 JX502.3 39.65,36.52 v41.78,36.52 41.78,40.01 41.4,40.39 39.65,40.39 JX502.9 | C504.P$2 31.13,38.35 30.71,37.92 29.52,37.92 29.08,37.49 29.08,36.81 U501.35 30.16,35.74 30.86,35.74 v31.19,36.07 | 24.23,33.58 23.83,33.58 U501.23 22.84,32.58 v22.84,31.34 C502.P$2 | U401.5 v32.69,29.54 | R402.P$1 32.26,29.97 v32.69,29.54 | v32.69,29.54 32.94,29.79 R401.P$1 34.14,31.75 GND..P$1 | C401.P$2 v35.5,27.5 v35.51,27.51 C102.P$2 | U102.7 v38.23,28.47 | 14.9,34.23 v14.91,34.24 14.87,34.2 U602.1 | v7.49,10.61 v7.49,10.62 | D401.A v47.45,3.94 | C305.P$2 62.13,37.9 v62.38,38.15
  Top 0.203: U301.11 C302.P$2 | C302.P$2 | R414.P$2 v33.02,42.8 | U303.5 54.62,46.84 v54.63,46.86 | U301.20 51.63,40.71 51.82,40.89 53.59,40.89 53.8,40.69 C304.P$2 | C302.P$2 51.63,35.63 51.31,35.31 v48.54,35.31 48.52,35.32 C301.P$2 | R612.P$1 v13.4,27.27 v13.41,27.28 | J601.3 1.41,22.59 S501.B3 1.41,20.18 2.29,19.3 4.33,19.3 C501.P$1 | U801.P$25 15.93,16.4 U801.P$10 15.93,18.66 v15.67,18.92 | C805.P$2 12.06,17.02 v11.05,16 | C806.P$2 v10.08,21.49 | L801.P$3 11.96,9.35 12.37,9.75 v13.26,9.75 14.04,9.75 L802.P$4 | R804.P$2 v11.46,6.45 | R804.P$2 | C804.P$2 12.11,12.08 v11.86,11.84 | C303.P$2 53.95,35.48 v53.52,35.05 | U701.2 33.15,13.66 U701.P$2 U701.GND | U701.6 33.45,13.16 U701.P$3 | U202.6 30.68,9.5 U202.P$3 | U202.GND U202.P$2 30.38,10 U202.2 | C202.P$2 GND.P$1 33.35,6.1 v30.48,6.1 v30.49,6.1 | 29.74,5.36 28.18,6.93 R206.P$2 | L202.P$3 v35.31,8.31 | v37.72,9.35 37.92,9.14 D202.A 37.73,8.31 L202.P$4 | v28.09,10.77 28.47,10.77 29.23,10.01 29.59,10.01 | v25.32,9.58 24.48,9.58 R816.P$2 | R814.P$1 v16,12.7 | R807.P$2 23.21,14 22.68,14.53 v19.91,14.53 C807.P$2 | R810.P$2 23.21,16.57 22.66,17.12 v19.91,17.12 C808.P$2 | C809.P$2 19.91,19 20.6,19.68 23.16,19.68 | R813.P$2 23.21,19.63 23.16,19.68 | v24.26,21.29 24.03,21.06 C803.P$2 23.21,20.84 23.21,19.74 23.16,19.68 | L601.P$4 30.86,13.41 31.17,13.72 31.17,14.4 v31.39,14.63 | D603.A v26.21,12.52 | L601.P$3 29.79,13.41 v29.11,12.72 | U102.4 U102.3 U102.2 | U102.1 U102.2 | U602.1 13.48,33.14 D601.A | U602.1 15.48,33.14 15.67,32.94 15.67,32.03 15.47,31.83 14.88,31.83 U602.3 | C602.P$2 18.98,31.89 v19,31.9 19.52,32.42 R503.P$2 | 34.55,16.22 34.55,15.77 v35.05,15.27 | U102.2 v38.23,25.58
  Top 0.25: U304.12 49.9,20.83 50.5,20.83 50.5,21.21 50.32,21.21 50.32,22.89 50.5,22.89 50.5,26.49 arc-68 49.48,28.02 arc-90 51,29.54 arc-90 52.53,28.02 arc-68 51.5,26.49 51.5,22.89 | U304.10 52.1,20.83 51.5,20.83 51.5,21.21
  Top 0.254: U701.6 U701.5 34.26,12.68 34.95,12.68 35.19,12.91 35.52,12.91 35.56,12.95 | J501.P$2 6.11,11.1 D501.A v7.49,10.61 | L201.P$3 24.09,7.87 D201.A 23.34,8.44 R816.P$2 | L201.P$4 v25.83,7.7 | U101.3 20.98,9.4 20.62,9.04 20.62,8.76 20.98,8.41 U101.1 21.66,7.76 v21.64,7.75 21.64,7.5 C101.P$2 | R701.P$1 36.57,12.91 v36.58,12.9 | C705.P$2 32.36,18.57 v32.56,18.36 32.79,18.59 U702.2
  Top 0.305: C802.P$2 9.38,20.79 v10.08,21.49
  Top 0.406: C705.P$2 31.44,17.32 C701.P$2 | UB301.2 v58.22,23.78 | 7.99,16.39 C801.P$2 8.3,16.38 v7.16,16.38 | v16.33,6.17 J801.6 16.28,4.76 15.03,4.76 J801.5 15.01,4.78 15.01,7.33 | J202.4 40.69,5.94 v41.05,6.3 | J201.6 29.74,5.36 v30.48,6.1
  Top 1.778: J601.30 J601.3 2.54,23.62
  Bottom 0.305: JX501.3 3.86,8.59 v4.83,7.62
  Bottom 1.778: J601.3 2.54,46.48
  other vias: 49.53,22.86 49.53,21.59 56.64,25.91 56.64,24.38 63.75,25.91 63.75,27.43 63.75,28.96 63.75,30.48 63.75,32 61.72,32 57.91,32 56.39,32 57.91,30.48 57.91,28.96 57.91,27.43 64.01,6.1 55.88,9.4 53.59,9.4 51.05,9.4 63.75,10.67 63.75,12.19 63.75,13.72 63.75,15.24 63.75,16.51 63.75,17.78 61.47,17.78 61.47,16.51 61.47,15.24 61.47,13.72 57.4,13.97 57.4,15.24 57.4,16.51 57.4,17.78 58.42,17.78 56.13,17.78 54.86,17.78 53.59,17.78 52.32,17.78 51.05,17.78 49.78,17.78 49.78,16.51 49.78,15.24 49.78,13.97 49.78,12.7 49.78,11.43 49.78,10.16 52.32,10.16 52.32,11.43 52.32,12.7 52.32,13.97 52.32,15.24 52.32,16.51 54.86,16.51 54.86,15.24 54.86,13.97 54.86,12.7 54.86,11.43 54.86,10.16
  pour Top (isolate 0.305): 48.9,6.86 55.12,6.86 55.12,4.32 65.1,4.32 65.1,32.51 46.56,32.51 46.56,24.31 48.9,21.97
  pour Ground (isolate 0.305): 0.03,0 54.33,0 54.33,6.1 48.23,6.1 48.23,21.79 45.97,24.05 45.97,49.28 62.23,49.28 62.23,48.62 46.61,48.62 46.61,33.25 63.04,33.25 63.04,32.54 46.56,32.54 46.56,24.31 48.9,21.97 48.9,6.86 55.12,6.86 55.12,4.34 65.1,4.34 65.1,56.01 0.03,56.01
IO-!RESET  (via drill 0.3 pad 0.46)
  Top 0.203: 21.51,40.83 U501.7 22.25,40.11 22.73,40.11 v23.11,39.73 | S501.A1 3.06,20.8 C501.P$2 4.88,20.85 v5.92,20.85 | U702.3 33.61,18.09 v33.17,17.65
  Bottom 0.203: v23.11,39.73 23.7,39.14 23.7,36.7 20.57,33.58 20.57,28.27 19.41,27.1 19.41,25.43 19,25.02 12.83,25.02 12.01,24.21 12.01,20.04 11.66,19.68 7.67,19.68 6.5,20.85 v5.92,20.85 4.83,19.76 4.83,17.53 6.45,15.9 6.45,15.19 4.83,13.56 4.83,8.89 9.14,4.57 17.58,4.57 20.83,7.82 20.83,10.41 25.91,15.49 31.01,15.49 v33.17,17.65
IO-!VDD_SERVO_IN_FAULT  (via drill 0.3 pad 0.46)
  Top 0.203: U501.38 28.4,38.14 v28.4,38.12 | v37.85,14.22 37.85,12.45 37.34,11.94 32.64,11.94 32.35,12.23 U701.4
  Bottom 0.203: v28.4,38.12 28.4,32.82 29.97,31.24 39.62,31.24 40.13,30.73 40.13,16.51 v37.85,14.22
IO-BOOT0
  Top 0.203: U501.44 28.47,42.46 R506.P$1 30.19,44.81 IO-BOOT0.P$1
IO-BOOT1
  Top 0.203: R503.P$1 20.97,32.84 U501.20
IO-CH1
  Top 0.203: U601.9 18.13,39.83 18.67,40.36 19.88,40.36 U501.10
IO-CH2
  Top 0.203: U601.8 18.39,39.33 18.92,39.85 19.68,39.85 U501.11
IO-CH3
  Top 0.203: U601.7 19.27,38.83 19.94,38.15 23.45,38.15 U501.45
IO-CH4  (via drill 0.3 pad 0.46)
  Top 0.203: U601.6 19.03,38.33 19.66,37.69 24.05,37.69 v26.16,39.8 | v25.4,41.15 25.75,41.15 U501.46
  Bottom 0.203: v25.4,41.15 26.16,40.39 v26.16,39.8
IO-CH5
  Top 0.203: U601.5 18.64,37.83 18.97,37.49 18.97,35.79 19.79,34.98 20.28,34.98 U501.16
IO-CH6
  Top 0.203: U601.4 18.35,37.33 18.57,37.11 18.57,35.61 19.61,34.57 20.58,34.57 U501.17
IO-CH7
  Top 0.203: U601.3 18.01,36.83 18.21,36.63 18.21,35.38 19.41,34.19 20.91,34.19 U501.18
IO-CH8
  Top 0.203: U601.1 17.13,35.83 19.15,33.81 21.23,33.81 U501.19
IO-SWCLK
  Top 0.203: U501.37 30.33,39.37 32.51,39.37 33.02,38.86 33.02,36.83 33.3,36.55 JX502.4
IO-SWDIO
  Top 0.203: U501.34 29.91,35.28 JX502.2
IO-SWO
  Top 0.203: U501.39 29.93,40.39 32.26,40.39 33.5,39.14 33.5,38.18 33.86,37.82 JX502.6
IO-USART1_RX  (via drill 0.3 pad 0.46)
  Top 0.203: J501.P$3 5.74,12.6 v6.35,13.21 | v26.14,36.96 26.14,36.93 U501.31
  Bottom 0.203: v6.35,13.21 9.91,13.21 13.46,16.76 13.46,21.34 14.63,22.5 16.87,22.5 18.06,23.7 21.31,23.7 22.35,24.74 22.35,28.19 21.84,28.7 21.84,32.66 v26.14,36.96
IO-USART2_RX  (via drill 0.3 pad 0.46)
  Top 0.203: R502.P$2 6.15,15.8 v5.56,15.21
  Bottom 0.203: v5.56,15.21 5.56,14.94 3.66,13.03 3.66,11.53 3.25,11.12 JX501.2
IO-USART2_TX  (via drill 0.3 pad 0.46)
  Top 0.203: R501.P$2 v4.8,15.85
  Bottom 0.203: v4.8,15.85 4.8,14.81 3.66,13.66 JX501.1
IO-VDD_3V3  (via drill 0.3 pad 0.46)
  Top 0.203: 16.89,40.87 20.08,40.87 U501.9 21.6,39.34 v22.28,39.34 | 16.89,40.87 16.5,40.48 U601.10 16.5,36.79 | C601.P$1 16.89,40.87 | 16.5,36.79 16.94,36.35 17.48,36.35 U601.2 | U601.19 14.43,36.33 14.91,36.8 15.75,36.8 | 15.75,36.8 16.48,36.8 16.5,36.79 | 36.86,18.59 C704.P$1 | U501.36 30.78,37.35 C504.P$1 32.15,37.35 v32.16,37.34 | JX502.1 v41.81,35.28 | C502.P$1 24.64,31.35 v24.64,32.26 24.09,32.26 U501.24 | 15.75,36.8 v15.75,35.05 16.47,34.33 U602.5 17.76,33.14 C602.P$1 | D401.C v49.78,4.7 49.8,4.71 J401.1 | U501.48 25.39,43.69 C503.P$1 25.39,43.7 v24.89,43.2
  Top 0.254: U702.7 36.86,18.59 | C704.P$1 C703.P$1 37.07,21.5 37.41,21.84 v38.58,21.84
  pour Power (isolate 0.305): 14.22,45.72 43.43,45.72 43.43,31.24 28.93,31.24 28.93,24.59 48.29,24.59 48.29,6.73 54.86,6.73 54.86,0 46.35,0 46.35,21.59 44.45,21.59 44.45,17.53 37.59,17.53 37.59,22.86 26.42,22.86 26.42,30.73 22.1,30.73 22.1,31.5 14.22,31.5
IO-VDD_5V5
  Top 0.203: LED402.A LED403.A LED405.A | LED405.A 28.65,48.7 | LED405.A 30.82,48.69 32.23,48.69 32.77,48.16 32.77,44.2 34.95,42.01 41.02,42.01 42.77,40.26 42.77,34.54 41.5,33.27 33.53,33.27 31.09,30.84 27.84,30.84 26.85,29.84 26.85,23.85 27.53,23.16 33.35,23.16 34.23,22.29 U702.1 33.49,19.09 33.27,19.3 31.17,19.3 C705.P$1
  Top 0.305: U702.4 34.23,17.36 32.61,15.75 30.58,15.75 30.02,16.31 30.02,16.83 C701.P$1
  Top 0.406: C705.P$1 30.44,17.27 C701.P$1 28.73,16.84 D701.3
LED-!RESET  (via drill 0.3 pad 0.46)
  Top 0.203: R401.P$2 33.41,28.06 U401.4 32.33,28.07 31.83,28.57 v31.7,28.57 | J101.P$13 22.17,49.81 21.46,49.81 20.57,48.92 20.57,46.99 v22.1,45.47
  Bottom 0.203: v22.1,45.47 22.1,42.93 24.89,40.13 24.89,39.12 27.48,36.52 27.48,32.28 31.19,28.57 v31.7,28.57
MPU_DRDY  (via drill 0.3 pad 0.46)
  Top 0.203: U301.12 52.03,37.23 52.63,36.63 52.63,35.1 52.07,34.54 47.75,34.54 46.99,35.31 46.99,37.69 v48.44,39.14
  Bottom 0.203: J101.P$22 35.03,52.5 35.03,50.47 36.52,48.97 39.52,48.97 46.58,41.91 46.58,41 v48.44,39.14
N$1
  Top 0.203: U301.10 51.23,36.69 C302.P$1
N$2
  Top 0.203: U302.10 59.3,40.09 C306.P$1
N$3
  Top 0.203: R610.P$1 R611.P$2
N$4
  Top 0.254: U701.8 34.25,15 33.98,15.27 27.26,15.27 D701.2
  Top 0.406: D702.2 26.3,19.88 27.15,19.02 27.15,17.42 D701.2
N$5
  Top 0.203: R404.P$1 R405.P$1 17.2,24.96 Q401.1
N$6
  Top 0.203: U501.43 29.8,43.08 R505.P$1
N$7
  pour Power: 30.99,11.68 30.99,8.38 24.38,8.38 24.38,5.59 37.85,5.59 37.85,11.68
N$8
  Top 0.203: U501.42 29.26,41.83 R504.P$1
N$9  (via drill 0.3 pad 0.46)
  Top 0.203: LED405.C 29.45,47.2 v27.96,45.72 | v32.51,33.53 32.51,33.15 31.14,31.77 R412.P$2
  Bottom 0.203: v27.96,45.72 27.96,45.36 33.33,40.01 33.33,34.34 v32.51,33.53
N$10
  Top 0.203: U302.8 61.63,38.55 C307.P$1
N$14
  Top 0.203: J202.2 38.19,6.5 R203.P$2
N$15
  Top 0.203: J202.3 39.44,6.35 R204.P$2
N$16
  Top 0.406: J202.1 36.93,6.2 36.47,6.66 L202.P$2 D202.C
N$17
  Top 0.203: R403.P$1 14.78,27.95 SG401.+
N$18
  Top 0.203: U501.6 20.7,42.36 C506.P$2 20.19,42.39 19.31,43.27 X501.1
N$19
  Top 0.203: U302.12 58.3,39.99 57.91,40.39 57.91,41.53 58.34,41.96 60.76,41.96 61.19,41.53 61.19,40.36 61.49,40.06 C307.P$2
N$20
  Top 0.254: R701.P$2 35.17,13.91 34.92,13.66 U701.7
N$21
  Top 0.203: Q401.3 19.58,28.15 SG401.-
N$22
  Top 0.203: U501.5 21.77,42.01 21.77,42.7 21.41,43.06 C505.P$1 20.37,43.11 18.95,44.53 18.95,45.98 X501.3
N$23
  Top 0.203: SJ301.1 57.66,43.69 56.64,42.67 56.64,37.34 56.95,37.03 57.57,37.03 U302.16
N$24
  Top 0.203: R208.P$1 12.39,46.37 U201.8
N$25
  Top 0.203: R209.P$1 14.44,47.02 14.81,47.4 15.48,47.4 U201.1
N$27
  Top 0.203: U202.7 31.91,10 32.11,9.8 32.11,8.19 R205.P$1
N$28  (via drill 0.3 pad 0.46)
  Top 0.203: R501.P$1 5.94,18.91 v5.94,19.58 | U501.12 20.24,38.58 22.91,38.58 v24.18,39.85
  Bottom 0.203: v5.94,19.58 7.04,19.58 7.42,19.2 12.01,19.2 12.5,19.68 12.5,23.9 13.16,24.56 19.33,24.56 19.86,25.09 19.86,26.82 21.01,27.96 21.01,33.2 24.18,36.37 v24.18,39.85
N$29
  Top 0.203: LED402.C 23.91,47.2 24.38,46.74 R409.P$2
N$30  (via drill 0.3 pad 0.46)
  Top 0.203: R502.P$1 6.15,18.34 v6.6,18.8 | U501.13 20.4,37.21 v25.2,37.21
  Bottom 0.203: v6.6,18.8 12.45,18.8 12.95,19.3 12.95,23.62 13.46,24.13 19.56,24.13 20.32,24.89 20.32,26.67 21.41,27.76 21.41,32.92 25.2,36.7 v25.2,37.21
N$31
  Top 0.406: R601.P$2 10.79,33.25 9.53,31.98 9.53,30.71 J601.7
N$32
  Top 0.203: 50.99,28 51,28 J301.5
  Top 0.25: U304.11 51,22.04 | L301.P$1 50.99,28
  Top 0.406: 51,22.04 L301.P$1
N$33  (via drill 0.3 pad 0.46)
  Top 0.203: UB301.1 60.82,22.81 R302.P$2 62.44,22.14 v62.74,21.84 | v61.72,9.4 61.72,7.67 U304.22
  Bottom 0.203: v62.74,21.84 62.74,10.41 v61.72,9.4
N$34
  Top 0.406: R301.1 55.82,21.88 54.99,21.06 53.54,21.06 53.21,20.73 53.21,19.66 U304.9
N$35
  Top 0.406: L301.P$2 R301.2
N$36
  Top 0.203: D301.C 63.92,23.29 R302.P$1
N$39
  Top 0.203: R411.P$2 R410.P$1
N$40  (via drill 0.3 pad 0.46)
  Top 0.203: LED403.C 26.49,46.15 v26.92,45.72 | v32.05,34.31 31.67,33.93 31.67,33.27 31.4,33 R410.P$2
  Bottom 0.203: v26.92,45.72 32.89,39.75 32.89,35.15 v32.05,34.31
N$43
  Top 0.203: U601.20 14.51,35.83 R601.P$1
N$44
  Top 0.203: U601.18 13.46,36.83 13.21,36.58 13.21,35.8 R602.P$1
N$45
  Top 0.203: U601.17 12.97,37.33 12.7,37.06 12.7,36.56 R603.P$1
N$46
  Top 0.406: D702.3 30.12,20.83 F701.2
N$47
  Top 0.152: U801.P$1 18.08,13.82 19.25,12.65 19.91,12.65 | C807.P$1 R806.P$1 22.17,12.66
  Top 0.203: 22.17,12.66 R805.P$2 | 19.91,12.65 C807.P$1
N$49
  Top 0.203: U601.16 12.7,37.83 R604.P$1
N$53
  Top 0.203: U601.15 R605.P$1
N$54
  Top 0.152: 22.05,13.66 R806.P$2 20.58,13.16 19.41,13.16 19.05,13.51 19.05,15.01 18.66,15.4 U801.P$2
  Top 0.203: 22.05,13.66 R807.P$1
N$55
  Top 0.152: U801.P$3 18.77,15.9 19.33,15.34 19.9,15.34 | 19.9,15.34 C808.P$1 | 19.9,15.34 21.07,15.34 R809.P$1 22.15,15.32 R808.P$2
  Top 0.203: 22.13,15.34 R808.P$2
N$56
  Top 0.152: 22.1,16.32 R809.P$2 20.58,15.82 19.46,15.82 18.88,16.4 U801.P$4
  Top 0.203: 22.1,16.32 R810.P$1
N$57  (via drill 0.3 pad 0.46)
  Top 0.203: R413.P$1 25.97,30.55 v26.19,30.33 | v35.51,24.59 35.51,23.72 35.99,23.24 46.05,23.24 47.47,21.82 47.47,6.93 48.49,5.92 52.02,5.92 52.58,5.36 J401.2
  Bottom 0.203: v26.19,30.33 31.93,24.59 v35.51,24.59
N$58
  Top 0.203: U601.14 12.7,38.83 R606.P$1
N$59
  Top 0.203: U601.13 12.97,39.33 12.7,39.6 12.7,40.1 R607.P$1
N$60
  Top 0.203: U601.12 13.49,39.83 13.26,40.06 13.26,40.81 R608.P$1
N$63
  Top 0.406: R602.P$2 10.16,34.52 9.53,33.88 9.53,33.25 J601.10
N$66
  Top 0.406: R608.P$2 10.79,42.14 9.53,43.41 9.53,44.68 J601.28
N$67
  Top 0.152: 22.05,18.91 R812.P$2 20.58,18.41 19.53,18.41 18.52,17.4 U801.P$6
  Top 0.203: 22.05,18.91 R813.P$1
N$68
  Top 0.406: R607.P$2 10.16,40.87 9.53,41.5 9.53,42.14 J601.25
N$69  (2 unrouted)
  Top 0.152: U801.P$5 18.66,16.9 19.67,17.91 C809.P$1
N$71
  Top 0.406: R606.P$2 9.53,39.6 J601.22
N$72
  Top 0.406: R605.P$2 8.26,38.33 J601.19
N$73
  Top 0.406: R604.P$2 8.26,37.06 J601.16
N$74
  Top 0.406: R603.P$2 9.53,35.79 J601.13
N$75
  Top 0.152: RN801.2 16.44,18.06
  Top 0.203: 16.44,18.06 U801.P$9
N$95
  Top 0.203: U401.6 29.94,29.55 R402.P$2
N$97
  Top 0.254: U801.P$18 13.74,14.9 13.49,14.66 13.49,14.12 13.21,13.84 U802.P$1
  Top 0.406: U802.P$3 11.48,15.16 11.11,14.79 11.11,13.92 | 11.11,13.92 C804.P$1 | U802.P$1 11.18,13.84 11.11,13.92
N$100
  Top 0.406: J201.1 23.49,6.71 D201.C 23.37,6.9 L201.P$2
N$102
  Top 0.203: L802.P$2 15.35,10.11 R802.P$2
N$103
  Top 0.203: L801.P$2 11.16,10.09 R801.P$2
N$104
  Top 0.203: U702.6 36.39,18.09 C702.P$1
N$105
  Top 0.203: U801.P$24 17.43,13.74 17.91,13.26 17.91,12.72 R814.P$2
N$106
  Top 0.203: U801.P$16 13.41,15.9 12.78,16.54 12.78,17.93 12.5,18.21 U803.P$1
  Top 0.406: U803.P$3 11.43,19.53 11.11,19.21 11.11,18.21 | 11.11,18.21 C805.P$1 | U803.P$1 11.11,18.21
N$107
  Top 0.203: U801.P$14 13.8,16.9 13.64,17.07 13.64,19.98 C806.P$1
N$110
  Top 0.406: D603.C D602.CATHODE 28.31,14.21 L601.P$1
N$113
  Top 0.152: U801.P$15 13.57,16.4 13.21,16.76 13.21,18.87 | 13.21,18.87 13.21,19.46 12.47,20.19 U803.P$4 | U803.P$2 13.21,18.87
N$115
  Top 0.152: U802.P$2 12.65,14.5 12.99,14.85 12.99,15.4 | U801.P$17 12.99,15.4 | 12.99,15.4 12.57,15.82 U802.P$4
PPM-SBUS-PROT
  Top 0.203: J601.1 9.4,25.5 9.4,28.96 10.93,30.49 R609.P$2
PPM_INPUT  (via drill 0.3 pad 0.46)
  Top 0.203: R609.P$1 13.3,31.95 D601.C | D601.C 13.47,31.99 14.54,30.91 21.89,30.91 22.58,30.23 v23.72,30.23 | v26.16,35.51 26.16,35.49 U501.29 | U602.2 13.84,32.49 D601.C
  Bottom 0.203: v23.72,30.23 24.89,30.23 26.16,31.5 v26.16,35.51
RGB_LED_3
  Top 0.203: U401.9 28.11,27.06 U402.C1
RGB_LED_4
  Top 0.203: U401.8 29.41,27.56 28.98,27.99 27.99,27.99 U402.C2
RGB_LED_14
  Top 0.203: U401.7 29.6,28.06 28.57,29.08 28,29.08 U402.C3
RPI-I2C_SCL  (via drill 0.3 pad 0.46)
  Top 0.203: R203.P$1 R201.P$1 38.24,10.02 v37.85,10.41 | v32.21,46.15 32.21,44.2 31.45,43.43 31.45,42.49 30.8,41.85 R504.P$2 | U302.1 56.64,36.32 56.13,36.83 56.13,41.4 55.37,42.16 49.53,42.16 47.75,43.94 47.75,46.23 48.37,46.84 U303.8 49.81,47.72 49.53,48.01 40.03,48.01 v38.1,46.08 | v43.69,29.72 42.49,29.72 41.53,30.68 39.78,30.68 39.5,30.4 U102.6 39.5,28.37 v38.89,27.76 | U401.3 32.26,27.56 32,27.81 v30.84,27.81 30.84,24.23 v30.73,24.13 | U101.10 17.56,7.84 v17.78,7.62
  Bottom 0.203: J101.P$5 14.78,49.89 16.71,49.89 18.14,48.46 29.9,48.46 v32.21,46.15 32.28,46.08 v38.1,46.08 43.94,40.23 43.94,29.97 v43.69,29.72 43.69,28.7 42.88,27.89 42.88,9.6 41.91,8.64 39.62,8.64 v37.85,10.41 | v38.89,27.76 38.89,26.72 38.48,26.31 36.45,26.31 35.46,25.32 32.38,25.32 30.84,26.87 v30.84,27.81 | v17.78,7.62 17.63,7.47 9.98,7.47 9.17,8.28 9.17,11.38 13.49,15.7 15.06,15.7 16.69,17.32 16.69,20.73 19.05,23.09 29.69,23.09 v30.73,24.13
RPI-I2C_SDA  (via drill 0.3 pad 0.46)
  Top 0.203: R204.P$1 40.62,9.4 | 40.62,9.4 R202.P$1 | v31.5,45.47 31.5,44.42 30.79,43.71 30.79,43.17 R505.P$2 | 51.05,48.51 39.62,48.51 37.08,45.97 v37.08,45.47 | 51.05,48.51 56.9,48.51 57.66,47.75 SJ301.2 | U303.7 51.06,48.5 51.05,48.51 | v41.66,9.4 40.62,9.4 | v42.95,28.98 42.34,28.98 41.58,29.74 U102.5 40.77,27.33 40.41,26.98 v38.1,26.98 | U401.2 31.84,27.06 v31.77,27.13 31.8,27.1 v31.8,23.82 | U101.9 18.81,8.9 v19.2,8.51
  Bottom 0.203: J101.P$3 12.68,49.45 16.48,49.45 17.91,48.03 28.7,48.03 31.27,45.47 v31.5,45.47 v37.08,45.47 43.48,39.06 43.48,30.68 42.95,30.15 v42.95,28.98 42.42,28.45 42.42,10.16 v41.66,9.4 | v38.1,26.98 36.45,26.98 35.2,25.73 33.17,25.73 v31.77,27.13 | v19.2,8.51 16.89,8.51 16.23,7.85 10.19,7.85 9.6,8.43 9.6,11.15 13.69,15.24 15.34,15.24 17.12,17.02 17.12,20.45 19.3,22.63 30.61,22.63 v31.8,23.82
RPI-SPI_MISO  (via drill 0.3 pad 0.46)
  Top 0.203: v50.83,38.08 v50.83,38.07 U301.9 | v60.58,10.19 59.89,10.19 59.49,9.78 59.49,7.66 U304.20
  Bottom 0.203: J101.P$21 33.76,50.57 35.81,48.51 39.34,48.51 46.08,41.78 46.08,40.44 48.44,38.08 v50.83,38.08 56.67,38.08 57.91,36.83 57.91,34.24 59.61,32.54 59.61,11.15 v60.58,10.19
RPI-SPI_MOSI  (via drill 0.3 pad 0.46)
  Top 0.203: v45.57,39.78 48.39,39.78 48.9,40.28 50.03,40.28 U301.24 | v60.6,9.17 U304.21
  Bottom 0.203: J101.P$19 32.56,49.89 33.48,49.89 35.31,48.06 39.06,48.06 45.57,41.55 v45.57,39.78 46.08,39.78 48.51,37.34 56.64,37.34 57.4,36.58 57.4,34.04 59.18,32.26 59.18,10.59 v60.6,9.17
RPI-SPI_SCK  (via drill 0.3 pad 0.46)
  Top 0.203: v48.03,40.49 48.03,40.89 48.39,41.25 50.04,41.25 50.42,40.87 50.42,40.2 U301.23 | v60.58,11.18 58.88,11.18 58.4,10.69 U304.19
  Bottom 0.203: J101.P$23 36.3,50.44 37.34,49.4 39.75,49.4 47.02,42.14 47.02,41.5 v48.03,40.49 48.28,40.74 57.56,40.74 58.42,39.88 58.42,34.44 60.1,32.77 60.1,11.66 v60.58,11.18
RPI-UART1_RX
  Top 0.203: J101.P$10 17.27,52.53 17.27,49.53 16.65,48.91 U201.4
RPI-UART1_TX
  Top 0.203: J101.P$8 14.73,52.53 14.73,49.53 14.11,48.91 U201.5
RPI-VDD_3V3  (via drill 0.3 pad 0.46)  (1 unrouted)
  Top 0.203: U201.6 11.04,48.41 C201.P$1 | U201.6 U201.7 | U201.6 U201.3 | U301.13 53.87,37.79 | C308.P$1 51.06,43.05 U303.2 U303.1 v48.87,44.65 | U101.8 19.71,9.4 20.09,9.02 20.09,6.95 C101.P$1 v20.07,4.93 | C102.P$1 35.55,29.75 U102.8 v36.96,28.52 36.96,27.23 34.65,24.92 34.65,23.62 35.56,22.71 39.45,22.71 40.21,21.95 40.21,13.95 39.22,12.95 R201.P$2 R202.P$2 42.07,11.02 42.93,10.16 42.93,5.33 v42.16,4.57 | U304.23 v62.8,9.19 v62.79,9.2 | C309.P$1 58.4,5.49 v58.98,6.07 | D301.A 62.42,25.56 v62.43,25.58 | v62.13,35.64 C305.P$1 59.87,36.38 U302.4 59.8,36.77 59.41,37.16 58.8,37.16 | U302.2 58.8,37.16 | 58.8,37.16 58.8,37.84 58.12,38.53 57.59,38.53 U302.13 | v54.56,38.84 v54.55,38.84 C304.P$1 53.8,37.76 C303.P$1 | 50.43,37 U301.8 50.43,36.97 49.55,36.09 C301.P$1 49.05,36.57 49.05,37.16 | U301.1 49.26,39.79 49.05,39.57 49.05,37.16 | 49.05,37.16 v47.7,37.16 | v35.03,26.49 35.02,26.5 C401.P$1 34.08,26.56 U401.1 32.66,26.53 | U401.10 29.97,26.53 29.97,25.55 v29.9,25.48 29.18,24.77 VDD_3V3.P$1 | R207.P$2 v27.39,10 v27.38,10.01
  Top 0.254: J101.P$1 10.97,48.63 C201.P$1
  Power 0.254: J101.P$1 9.67,52.53 27.38,52.53 J101.P$17
  Bottom 0.203: v42.16,4.57 27.43,4.57 | 27.43,4.57 20.42,4.57 v20.07,4.93 | v27.38,10.01 27.38,4.62 27.43,4.57
  pour Power (isolate 0.305): 26.16,49.99 44.2,49.99 44.2,34.8 63.25,34.8 63.25,34.29 46.56,34.29 46.56,30.66 29.46,30.66 29.46,25.15 48.87,25.15 48.87,7.57 55.42,7.57 55.42,0 65.07,0 65.07,56.03 26.16,56.03
RPI_AUX_ADC1
  Top 0.203: U101.7 16.88,9.9 16.61,9.63 16.61,7.52 RPI_AUX_ADC.P$1
RX-VDD_5V5
  Top 0.305: J601.2 6.78,22.02 8.71,22.02 8.97,22.28 24.21,22.28 24.61,22.68 32.49,22.68 32.94,22.23 F701.1
SAFETY  (via drill 0.3 pad 0.46)  (1 unrouted)
  Top 0.203: U501.41 29.28,41.15 31.5,41.15 | R414.P$1 v33.02,41.78 | v37.85,32.26 38.79,31.32 43.87,31.32 44.6,30.58 44.6,25.43 48.01,22.02 48.01,7.11 48.77,6.35 52.86,6.35 53.82,5.38 J401.3
  Bottom 0.203: v33.02,41.78 37.85,36.96 v37.85,32.26
SBUS_INPUT
  Top 0.203: U501.22 20.89,31.34 17.42,31.34 16.93,31.84 U602.4
SERIAL1_RX  (via drill 0.3 pad 0.46)
  Top 0.203: R209.P$2 15.44,45.1 S1RX.P$1 v14.76,43.28 | v25.98,6.1 J201.3
  Bottom 0.203: v14.76,43.28 14.76,44.81 17.09,47.14 28.19,47.14 30.91,44.42 36.8,44.42 42.52,38.71 42.52,31.6 41.5,30.58 41.5,14.33 39.32,12.14 26.82,12.14 26.06,11.38 26.06,8.41 26.47,8 26.47,7.39 25.98,6.91 v25.98,6.1
SERIAL1_TX  (via drill 0.3 pad 0.46)
  Top 0.203: R208.P$2 13.02,44.59 S1TX.P$1 13.72,43.56 v13.72,43.18 | v26.67,6.68 25.6,6.68 24.77,5.84 24.77,4.73 J201.2
  Bottom 0.203: v13.72,43.18 13.72,44.4 16.92,47.6 28.42,47.6 31.14,44.88 36.98,44.88 42.98,38.89 42.98,31.34 41.96,30.33 41.96,14.15 39.55,11.73 27.38,11.73 26.52,10.87 26.52,8.91 26.98,8.46 26.98,6.99 v26.67,6.68
VBUS  (via drill 0.3 pad 0.46)
  Top 0.203: U801.P$19 14.93,14.14 v14.35,13.56 | v24.18,18.49 23.84,18.49 R811.P$1
  Bottom 0.203: v14.35,13.56 19.28,18.49 v24.18,18.49
VDD_3V3_SPEKTRUM  (via drill 0.3 pad 0.46)
  Top 0.203: 35.86,19.12 U702.8 | D501.C v6.6,8.89
  Top 0.254: 35.86,19.12 C706.P$1 35.86,21.8 v35.81,21.84 | J501.P$1 D501.C
  Power 0.254: v6.6,8.89 6.6,5.59 9.14,3.05 36.32,3.05 38.61,5.33 38.61,12.12 35.81,14.91 v35.81,21.84
VDD_3V3_SPEKTRUM_EN  (via drill 0.3 pad 0.46)
  Top 0.203: U702.5 35.83,16.66 R702.P$2 36.19,15.75 v38.41,15.75 | U501.2 24.47,41.43 v24.56,41.43
  Bottom 0.203: v38.41,15.75 39.7,17.04 39.7,30.28 39.17,30.81 29.77,30.81 27.96,32.61 27.96,36.68 25.32,39.32 25.32,40.34 24.56,41.1 v24.56,41.43
VDD_5V_BRICK  (via drill 0.3 pad 0.46)
  Top 0.152: U801.P$21 15.93,13.59 v14.73,12.39 14.73,12.34 15.09,11.99 22.57,11.99 R805.P$1
  Top 0.203: v10.67,11.15 10.11,11.15 10.08,11.18
  Top 0.406: C801.P$1 U802.P$7 U802.P$8 10.08,11.18 10.08,5.59 | J801.2 J801.1 10.08,5.59 | VDD_5V_BRICK.P$1 10.01,5.66 10.08,5.59
  Bottom 0.203: v14.73,12.39 13.34,12.39 12.09,11.15 v10.67,11.15
VDD_5V_IN  (via drill 0.3 pad 0.46)
  Top 0.203: U801.P$12 14.94,19.56 v14.81,19.68 | RN801.7 RN801.6 RN801.5 v18.59,20.64 v18.59,20.65 | v23.72,29.11 23.73,29.12 U402.A3 U402.A2 U402.A1 | R815.P$2 v25.38,10.85 | R403.P$2 14.78,23.52 VDD_5V_IN.P$1 15.88,23.5 v16.26,23.11
  Top 0.254: U202.1 29.58,10.65 v29.11,11.12
  Top 0.406: U802.P$6 U802.P$5 10.08,16.38 v10.26,16.56 | D701.1 25.82,18.3 | 25.82,18.3 25.12,19 25.12,20.77 D702.1 | v11.02,20.45 10.77,20.19 U803.P$5 U803.P$6 | C803.P$1 19,21.06 v18.59,20.65 | 25.82,18.3 25.02,17.5 v25.02,17.48
  pour Power (isolate 0.305): 16.76,15.24 16.76,9.14 30.23,9.14 30.23,12.34 34.11,12.34 34.11,22.23 25.63,22.23 25.63,29.97 21.36,29.97 21.36,30.71 13.44,30.71 13.44,46.48 43.46,46.48 43.46,49.28 24.77,49.28 24.77,56.01 6.71,56.01 6.71,48.77 9.65,48.77 9.65,15.24
VDD_5V_PERIPH
  Top 0.254: U202.8 33.34,10.5 C202.P$1 36.04,10.59 36.47,10.16 L202.P$1 | 31.47,10.51 31.47,11.23 30.91,11.79 28.09,11.79 26.64,10.34 26.64,9.02 26.12,8.5 L201.P$1
  Top 0.305: 31.47,10.51 U202.8
VDD_5V_SENS
  Top 0.203: R815.P$1 R816.P$1 22.96,9.6 22.66,9.9 U101.4
VDD_SERVO  (via drill 0.3 pad 0.46)
  Top 0.152: U801.P$20 15.43,13.78 14.63,12.98 13.21,12.98 v13.08,13.11
  Top 0.203: R610.P$2 VDD_SERVO.P$1 v10.79,24.99 | R808.P$1 24.73,15.27 D602.ANODE
  Top 0.305: D602.ANODE 23.73,11.53 14.22,11.53 13.08,12.68 v13.08,13.11
  Top 0.406: U803.P$8 U803.P$7 8.32,18.87 | 8.32,18.87 8.31,18.86 v8.31,18.03 | 8.32,18.87 C802.P$1
  Top 1.778: J601.29 J601.26 J601.23 J601.20 J601.17 J601.14 J601.11 J601.8 J601.5
  Power 0.203: J601.5 6.35,24.99 v10.79,24.99
  Bottom 1.778: J601.29 5.08,26.42
  pour Power (isolate 0.305): 8.89,29.97 0,29.97 0,11.94 16.26,11.94 16.26,14.48 8.89,14.48
VDD_SERVO_IN
  Top 0.254: L601.P$2 31.36,12.61 31.67,12.93 31.67,13.92 31.92,14.16 U701.1
VDD_SERVO_SENS  (via drill 0.3 pad 0.46)
  Top 0.203: R611.P$1 R612.P$2 v11.46,26.47 | U501.14 20.64,36.75 22.15,36.75 v22.35,36.55
  Bottom 0.203: v22.35,36.55 20.14,34.34 20.14,28.55 18.06,26.47 v11.46,26.47